# Altium schematic sheet Ethernet_1.SchDoc
size A4; SheetNumber: 13; SheetTotal: 13
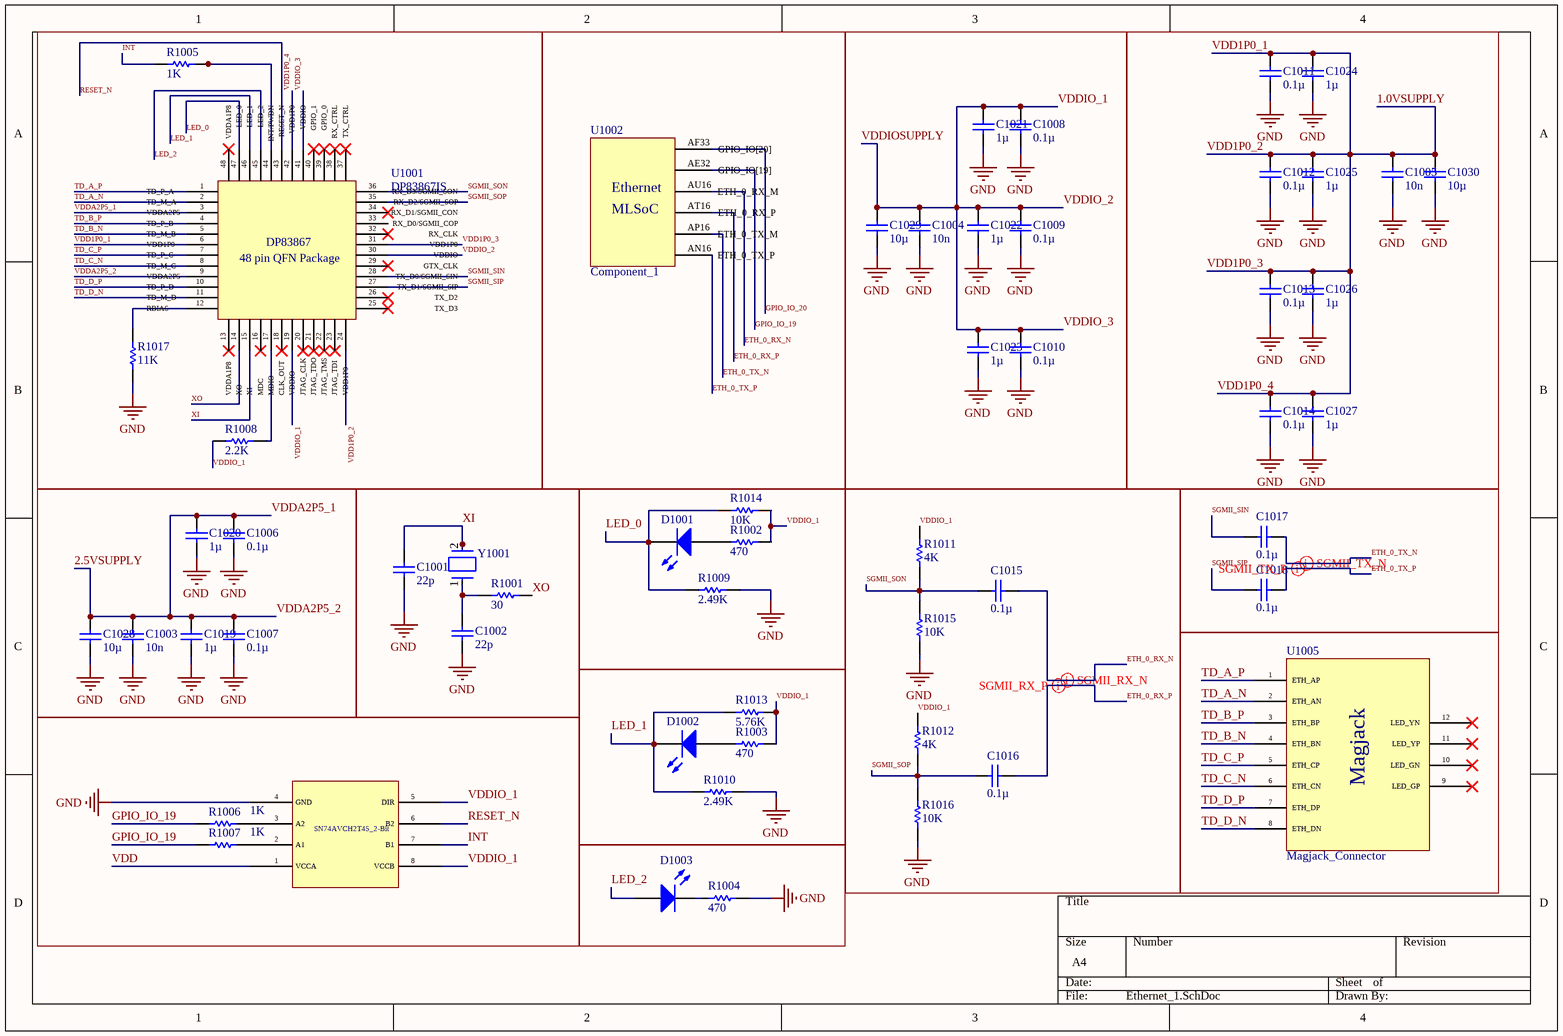
[diagram p0: Ethernet_1.SchDoc]

## Parts
*?  Component_1  (value not drawn)
C1001  value 22p  (hidden comment: Capacitor)
C1002  value 22p  (hidden comment: Capacitor)
C1003  value 10n  (hidden comment: Capacitor)
C1004  value 10n  (hidden comment: Capacitor)
C1005  value 10n  (hidden comment: Capacitor)
C1006  value 0.1µ  (hidden comment: Capacitor)
C1007  value 0.1µ  (hidden comment: Capacitor)
C1008  value 0.1µ  (hidden comment: Capacitor)
C1009  value 0.1µ  (hidden comment: Capacitor)
C1010  value 0.1µ  (hidden comment: Capacitor)
C1011  value 0.1µ  (hidden comment: Capacitor)
C1012  value 0.1µ  (hidden comment: Capacitor)
C1013  value 0.1µ  (hidden comment: Capacitor)
C1014  value 0.1µ  (hidden comment: Capacitor)
C1015  value 0.1µ  (hidden comment: Capacitor)
C1016  value 0.1µ  (hidden comment: Capacitor)
C1017  value 0.1µ  (hidden comment: Capacitor)
C1018  value 0.1µ  (hidden comment: Capacitor)
C1019  value 1µ  (hidden comment: Capacitor)
C1020  value 1µ  (hidden comment: Capacitor)
C1021  value 1µ  (hidden comment: Capacitor)
C1022  value 1µ  (hidden comment: Capacitor)
C1023  value 1µ  (hidden comment: Capacitor)
C1024  value 1µ  (hidden comment: Capacitor)
C1025  value 1µ  (hidden comment: Capacitor)
C1026  value 1µ  (hidden comment: Capacitor)
C1027  value 1µ  (hidden comment: Capacitor)
C1028  value 10µ  (hidden comment: Capacitor)
C1029  value 10µ  (hidden comment: Capacitor)
C1030  value 10µ  (hidden comment: Capacitor)
D1001  Light-Emitting Diode  (value not drawn)
D1002  Light-Emitting Diode  (value not drawn)
D1003  Light-Emitting Diode  (value not drawn)
R1001  value 30  (hidden comment: Resistor)
R1002  value 470  (hidden comment: Resistor)
R1003  value 470  (hidden comment: Resistor)
R1004  value 470  (hidden comment: Resistor)
R1005  value 1K  (hidden comment: Resistor)
R1006  value 1K  (hidden comment: Resistor)
R1007  value 1K  (hidden comment: Resistor)
R1008  value 2.2K  (hidden comment: Resistor)
R1009  value 2.49K  (hidden comment: Resistor)
R1010  value 2.49K  (hidden comment: Resistor)
R1011  value 4K  (hidden comment: Resistor)
R1012  value 4K  (hidden comment: Resistor)
R1013  value 5.76K  (hidden comment: Resistor)
R1014  value 10K  (hidden comment: Resistor)
R1015  value 10K  (hidden comment: Resistor)
R1016  value 10K  (hidden comment: Resistor)
R1017  value 11K  (hidden comment: Resistor)
U1001  DP83867IS  [DP83867gg]
U1002  Component_1
U1005  Magjack_Connector
Y1001  ABM3-25.000MHZ-B2-T  [FP-ABM3-MFG]  (value not drawn)

## Nets
GND: *?.4(GND) C1001.1 C1002.1 C1003.1 C1004.1 C1005.1 C1006.1 C1007.1 C1008.1 C1009.1 C1010.1 C1011.1 C1012.1 C1013.1 C1014.1 C1019.1 C1020.1 C1021.1 C1022.1 C1023.1 C1024.1 C1025.1 C1026.1 C1027.1 C1028.1 C1029.1 C1030.1 R1004.2 R1009.2 R1010.2 R1015.1 R1016.1 R1017.1
1.0VSUPPLY: C1005.2 C1011.2 C1012.2 C1013.2 C1014.2 C1024.2 C1025.2 C1026.2 C1027.2 C1030.2 U1001.6(VDD1P0) U1001.24(VDD1P0) U1001.31(VDD1P0) U1001.42(VDD1P0)  [also labelled VDD1P0_1, VDD1P0_2, VDD1P0_3, VDD1P0_4]
2.5VSUPPLY: C1003.2 C1006.2 C1007.2 C1019.2 C1020.2 C1028.2 U1001.3(VDDA2P5) U1001.9(VDDA2P5)  [also labelled VDDA2P5_1, VDDA2P5_2]
ETH_0_RX_N: C1015.2 U1002.AU16(ETH_0_RX_M)
ETH_0_RX_P: C1016.2 U1002.AT16(ETH_0_RX_P)
ETH_0_TX_N: C1017.2 U1002.AP16(ETH_0_TX_M)
ETH_0_TX_P: C1018.2 U1002.AN16(ETH_0_TX_P)
GPIO_IO_19: R1006.2 R1007.2 U1002.AE32(GPIO_IO[19])
GPIO_IO_20: U1002.AF33(GPIO_IO[20])
INT: *?.7(B1) R1005.1
LED_0: D1001.2(K) R1009.1 R1014.1 U1001.47(LED_0)
LED_1: D1002.2(K) R1010.1 R1013.1 U1001.46(LED_1)
LED_2: D1003.1(A) U1001.45(LED_2)
RESET_N: *?.6(B2) U1001.43(RESET_N)
SGMII_SIN: C1017.1 U1001.28(TX_D0/SGMII_SIN)
SGMII_SIP: C1018.1 U1001.27(TX_D1/SGMII_SIP)
SGMII_SON: C1015.1 R1011.1 R1015.2 U1001.36(RX_D3/SGMII_SON)
SGMII_SOP: C1016.1 R1012.1 R1016.2 U1001.35(RX_D2/SGMII_SOP)
TD_A_N: U1001.2(TD_M_A) U1005.2(ETH_AN)
TD_A_P: U1001.1(TD_P_A) U1005.1(ETH_AP)
TD_B_N: U1001.5(TD_M_B) U1005.4(ETH_BN)
TD_B_P: U1001.4(TD_P_B) U1005.3(ETH_BP)
TD_C_N: U1001.8(TD_M_C) U1005.6(ETH_CN)
TD_C_P: U1001.7(TD_P_C) U1005.5(ETH_CP)
TD_D_N: U1001.11(TD_M_D) U1005.8(ETH_DN)
TD_D_P: U1001.10(TD_P_D) U1005.7(ETH_DP)
VDD: *?.1(VCCA)
VDDIO_1: *?.5(DIR) *?.8(VCCB) C1004.2 C1008.2 C1009.2 C1010.2 C1021.2 C1022.2 C1023.2 C1029.2 R1002.2 R1003.2 R1008.1 R1011.2 R1012.2 R1013.2 R1014.2 U1001.19(VDDIO) U1001.30(VDDIO) U1001.41(VDDIO)  [also labelled VDDIO_2, VDDIO_3, VDDIOSUPPLY]
XI: C1001.2 U1001.15(XI) Y1001.2
XO: R1001.2 U1001.14(XO)
Net*?_2: *?.2(A1) R1007.1
Net*?_3: *?.3(A2) R1006.1
NetC1002_2: C1002.2 R1001.1 Y1001.1
NetD1001_1: D1001.1(A) R1002.1
NetD1002_1: D1002.1(A) R1003.1
NetD1003_2: D1003.2(K) R1004.1
NetR1005_2: R1005.2 U1001.44(INT/PWDN)
NetR1008_2: R1008.2 U1001.17(MDIO)
NetR1017_2: R1017.2 U1001.12(RBIAS)

Not connected (* = marked no-connect by the designer): U1001 13(VDDA1P8)* 16(MDC)* 18(CLK_OUT)* 20(JTAG_CLK)* 21(JTAG_TDO)* 22(JTAG_TMS)* 23(JTAG_TDI)* 25(TX_D3)* 26(TX_D2)* 29(GTX_CLK)* 32(RX_CLK)* 33(RX_D0/SGMII_COP) 34(RX_D1/SGMII_CON)* 37(TX_CTRL)* 38(RX_CTRL)* 39(GPIO_0)* 40(GPIO_1)* 48(VDDA1P8)*; U1005 9(LED_GP)* 10(LED_GN)* 11(LED_YP)* 12(LED_YN)*

## Layout directives
differential pair: ETH_0_RX_N, ETH_0_RX_P, ETH_0_TX_N, ETH_0_TX_P

## Notes on the sheet
- (in symbol Component_1) Ethernet; MLSoC; SN74AVCH2T45_2-Bit
- (in symbol DP83867IS) DP83867; 48 pin QFN Package
- (in symbol Magjack_Connector) Magjack

## Library data of the parts
C1001-C1030 = Capacitor: SimulationGenericComponent: True
D1001-D1003 = LED: AF: 1; BV: 0; BV_MAX: 1e99; EG: 1.11; FC: 0.5; IBV: 0.001; IS: 1e-14; MJSW: 0.33; NTUN: 30; TNOM: 27; XTI: 3; SimulationGenericComponent: True; CJO: 0; CJP: 0; CTA: 0; CTP: 0; FCS: 0.5; FV_MAX: 1e99; IKF: 0; IKR: 0; ISR: 1e-14; JSW: 0; JTUN: 0; JTUNSW: 0; KEG: 1; KF: 0; LEVEL: 1; N: 1; NBV: 1; NR: 1; NS: 1; PHP: 1; RS: 0; TCV: 0; TLEV: 0; TLEVC: 0; TM1: 0; TM2: 0; TPB: 0; TPHP: 0; TRS: 0; TRS2: 0; TT: 0; TTT1: 0; TTT2: 0; VJ: 1; XTITUN: 3
R1001-R1017 = Resistor: TC1: 0; SimulationGenericComponent: True; TC2: 0
Y1001 = CMP-2000-05729-2: Crystal 25MHz ±20ppm 18pF SMD-2 5mm x 3.2mm; Insulation Resistance: 500MR; Frequency Stability: 50ppm; ESR (Equivalent Series Resistance): 30R; Operating Frequency: 25 MHz; Termination: SMD/SMT; REACH SVHC: Yes; Max Operating Temperature: 70°C; Packaging: Tape and Reel; Tolerance: 20ppm; Load Capacitance: 18pF; Depth: 3.2mm; Height: 0.051inch; Min Operating Temperature: -20°C; Length: 5mm; Mount: Surface Mount; Resistor Type: Ceramic; Width: 0.126inch; Case/Package: CSMD; Frequency Tolerance: 20ppm; Package Quantity: 1000; Number of Pins: 2; RoHS Compliant: Yes; Frequency: 25MHz; Series Resistance: 30R; Series: ABM3; Lead Free: Lead Free